# EAGLE design beacon7012 (EAGLE 6.5.0)
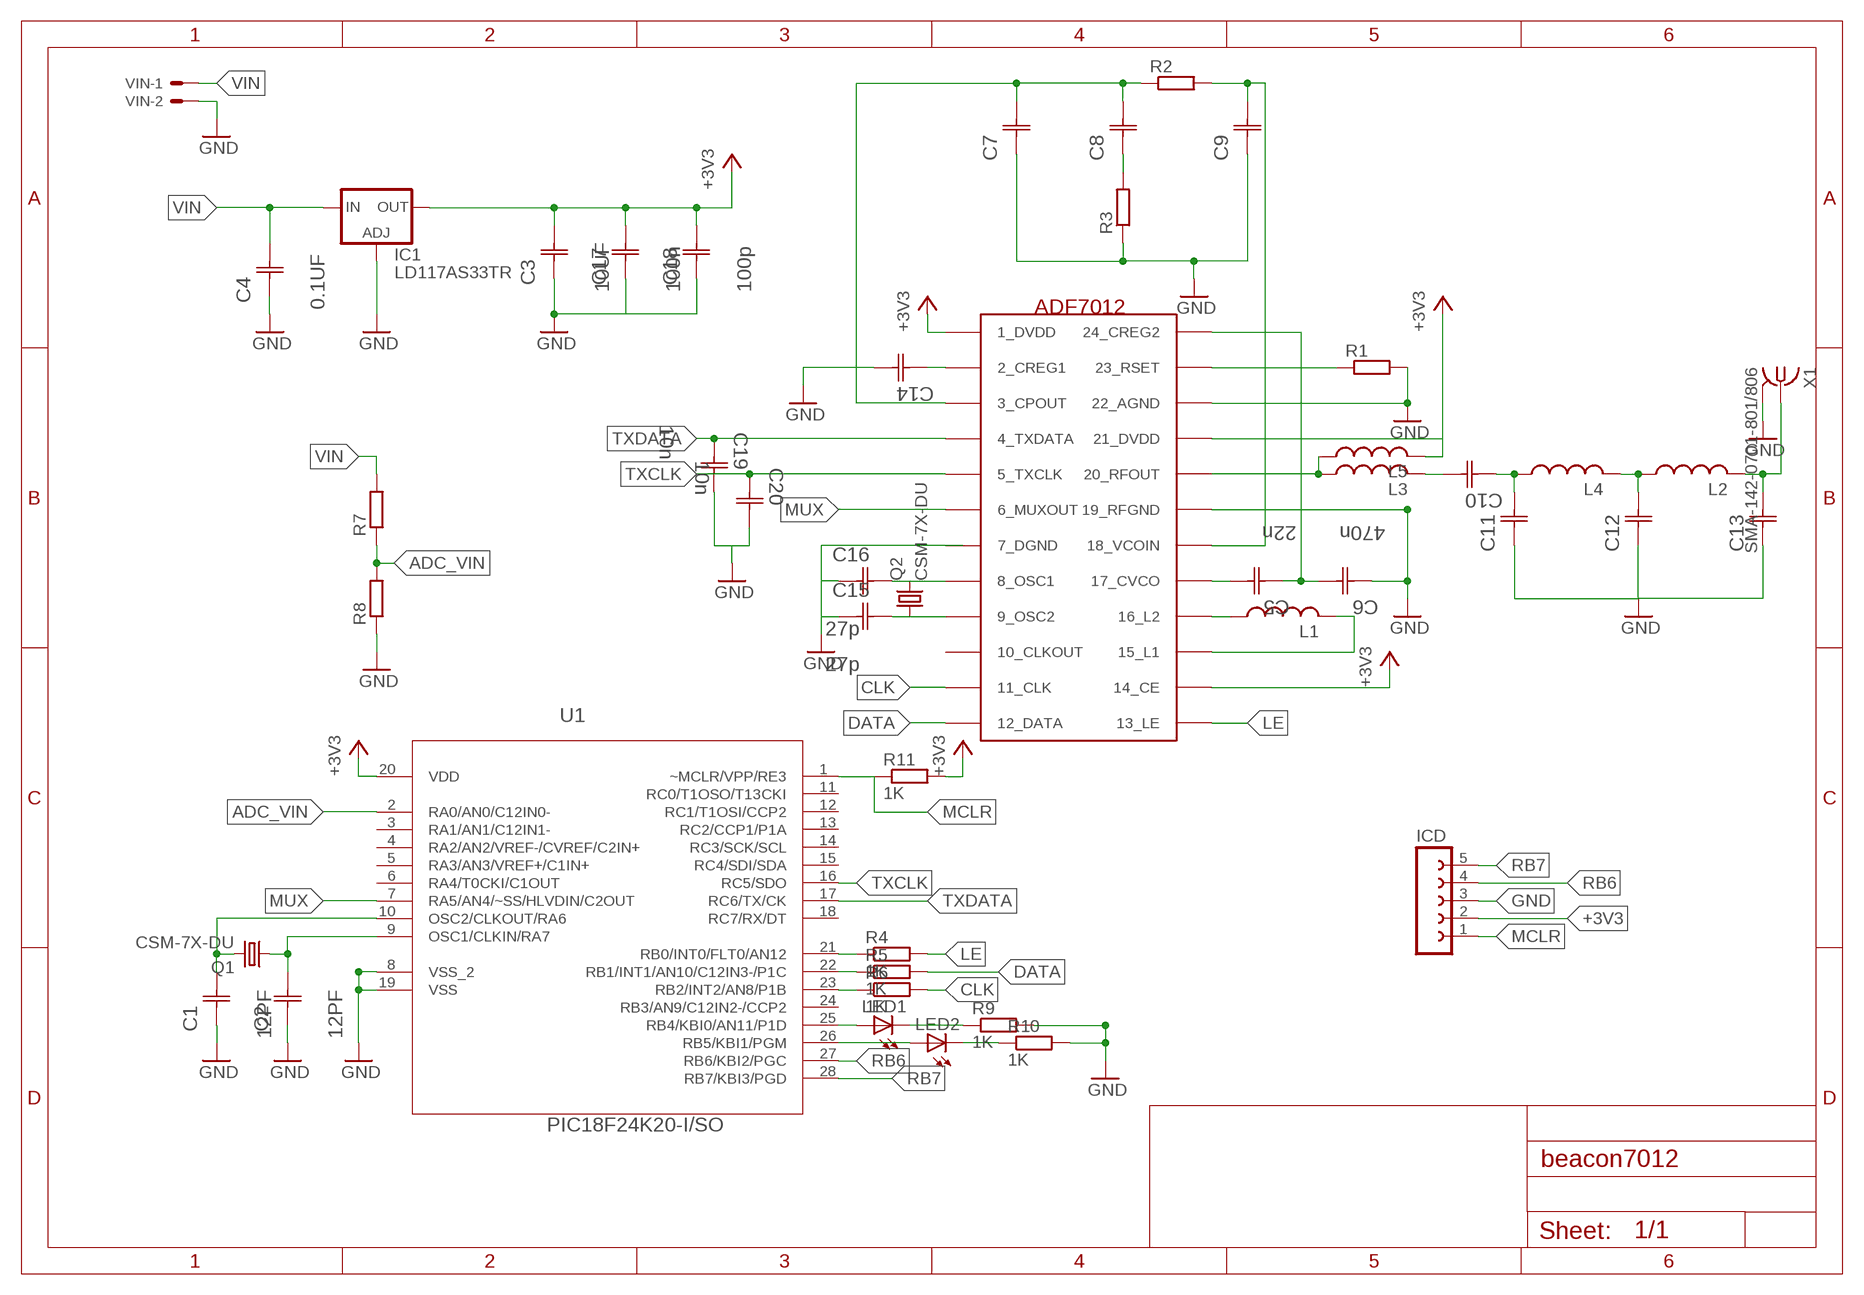
[diagram p0: schematic, sheet 1]

## Parts
C1  12PF  0805YA120JAT2A  [CAPC2012X94N]
C2  12PF  0805YA120JAT2A  [CAPC2012X94N]
C3  10UF  0805YD106MAT2A  [CAPC2013X140N]
C4  0.1UF  0805ZC104MAT2A  [CAPC2012X94N]
C5  22n  0805ZC104MAT2A  [CAPC2012X94N]
C6  470n  0805ZC104MAT2A  [CAPC2012X94N]
C7  0805YD106MAT2A  [CAPC2013X140N]
C8  0805YD106MAT2A  [CAPC2013X140N]
C9  0805YD106MAT2A  [CAPC2013X140N]
C10  0805ZC104MAT2A  [CAPC2012X94N]
C11  0805YD106MAT2A  [CAPC2013X140N]
C12  0805YD106MAT2A  [CAPC2013X140N]
C13  0805YD106MAT2A  [CAPC2013X140N]
C14  0805ZC104MAT2A  [CAPC2012X94N]
C15  27p  0805ZC104MAT2A  [CAPC2012X94N]
C16  27p  0805ZC104MAT2A  [CAPC2012X94N]
C17  100n  0805YD106MAT2A  [CAPC2013X140N]
C18  100p  0805YD106MAT2A  [CAPC2013X140N]
C19  10n  0805ZC104MAT2A  [CAPC2012X94N]
C20  10n  0805ZC104MAT2A  [CAPC2012X94N]
IC1  LD117AS33TR  [SOT223]
ICD  FE05-1  [FE05-1]
L1  L-USL2825P  [L2825P]
L2  L-USL2825P  [L2825P]
L3  L-USL2825P  [L2825P]
L4  L-USL2825P  [L2825P]
L5  L-USL2825P  [L2825P]
LED1  LEDSML0805  [SML0805]
LED2  LEDSML0805  [SML0805]
Q1  CSM-7X-DU  [CSM-7X-DU]
Q2  CSM-7X-DU  [CSM-7X-DU]
R1  R-EU_R0805  [R0805]
R2  R-EU_R0805  [R0805]
R3  R-EU_R0805  [R0805]
R4  1K  R-EU_R0805  [R0805]
R5  1K  R-EU_R0805  [R0805]
R6  1K  R-EU_R0805  [R0805]
R7  R-EU_R0805  [R0805]
R8  R-EU_R0805  [R0805]
R9  1K  R-EU_R0805  [R0805]
R10  1K  R-EU_R0805  [R0805]
R11  1K  R-EU_R0805  [R0805]
U1  PIC18F24K20-I/SO  [SOIC127P1030X265-28N]
U$1  ADF7012  [ADF7012]
VIN  KK-156-2  [KK-156-2]
X1  SMA-142-0701-801/806  [J502-ND-142-0701-801/806]

## Nets
+3V3: C3.2(C2) C17.2(C2) C18.2(C2) IC1.4(OUT) ICD.2 L5.2 R11.2 U1.20(VDD) U$1.1_DVDD U$1.14_CE U$1.21_DVDD
ADC_VIN: R7.1 R8.2 U1.2(RA0/AN0/C12IN0-)
CLK: R6.2 U$1.11_CLK
DATA: R5.2 U$1.12_DATA
GND: C1.1(C1) C2.1(C1) C3.1(C1) C4.1(C1) C6.1(C1) C7.1(C1) C9.1(C1) C11.1(C1) C12.1(C1) C13.1(C1) C14.2(C2) C15.1(C1) C16.1(C1) C17.1(C1) C18.1(C1) C19.2(C2) C20.2(C2) IC1.1(ADJ) ICD.3 R1.2 R3.1 R8.1 R9.2 R10.2 U1.8(VSS_2) U1.19(VSS) U$1.19_RFGND U$1.22_AGND VIN.2 X1.G@1 X1.G@2 X1.G@3 X1.G@4
LE: R4.2 U$1.13_LE
MCLR: ICD.1 R11.1 U1.1(~MCLR/VPP/RE3)
MUX: U1.7(RA5/AN4/~SS/HLVDIN/C2OUT) U$1.6_MUXOUT
N$1: C1.2(C2) Q1.2 U1.10(OSC2/CLKOUT/RA6)
N$2: C2.2(C2) Q1.1 U1.9(OSC1/CLKIN/RA7)
N$3: R5.1 U1.22(RB1/INT1/AN10/C12IN3-/P1C)
N$6: C16.2(C2) Q2.2 U$1.8_OSC1
N$8: R1.1 U$1.23_RSET
N$9: L1.1 U$1.16_L2
N$10: L1.2 U$1.15_L1
N$11: C5.2(C2) U$1.17_CVCO
N$12: C5.1(C1) C6.2(C2) U$1.24_CREG2
N$13: C7.2(C2) C8.2(C2) R2.1 U$1.3_CPOUT
N$14: C9.2(C2) R2.2 U$1.18_VCOIN
N$15: C8.1(C1) R3.2
N$16: C12.2(C2) L2.1 L4.2
N$17: L3.1 L5.1 U$1.20_RFOUT
N$18: C10.1(C1) C11.2(C2) L4.1
N$19: C13.2(C2) L2.2 X1.1
N$20: C15.2(C2) Q2.1 U$1.9_OSC2
N$21: LED1.A U1.25(RB4/KBI0/AN11/P1D)
N$22: C10.2(C2) L3.2
N$23: C14.1(C1) U$1.2_CREG1
N$24: R6.1 U1.23(RB2/INT2/AN8/P1B)
N$25: R4.1 U1.21(RB0/INT0/FLT0/AN12)
N$26: LED2.A U1.26(RB5/KBI1/PGM)
N$27: LED1.C R9.1
N$28: LED2.C R10.1
RB6: ICD.4 U1.27(RB6/KBI2/PGC)
RB7: ICD.5 U1.28(RB7/KBI3/PGD)
TXCLK: C20.1(C1) U1.16(RC5/SDO) U$1.5_TXCLK
TXDATA: C19.1(C1) U1.17(RC6/TX/CK) U$1.4_TXDATA
VIN: C4.2(C2) IC1.3(IN) R7.2 VIN.1
Unconnected: U1.3(RA1/AN1/C12IN1-) U1.4(RA2/AN2/VREF-/CVREF/C2IN+) U1.5(RA3/AN3/VREF+/C1IN+) U1.6(RA4/T0CKI/C1OUT) U1.11(RC0/T1OSO/T13CKI) U1.12(RC1/T1OSI/CCP2) U1.13(RC2/CCP1/P1A) U1.14(RC3/SCK/SCL) U1.15(RC4/SDI/SDA) U1.18(RC7/RX/DT) U1.24(RB3/AN9/C12IN2-/CCP2) U$1.7_DGND U$1.10_CLKOUT

## Library data of the parts
C1 C2 = AVX_By_element14_Batch_1:0805YA120JAT2A: Capacitor 0805; MPN: 0805YA120JAT2A; OC_FARNELL: -; OC_NEWARK: 55J5411; SUPPLIER: AVX; TOLERANCE: ± 5%; VOLTAGERATING: 16V
C3 = AVX_By_element14_Batch_1:0805YD106MAT2A: Capacitor 0805; MPN: 0805YD106MAT2A; OC_FARNELL: 1582704; OC_NEWARK: 66M3391; SUPPLIER: AVX; TOLERANCE: ±20%; VOLTAGERATING: 16V
C4 = AVX_By_element14_Batch_1:0805ZC104MAT2A: Capacitor 0805; MPN: 0805ZC104MAT2A; OC_FARNELL: -; OC_NEWARK: 55J5552; SUPPLIER: AVX; TOLERANCE: ±20%; VOLTAGERATING: 10V
C5 C6 C10 C14-C16 C19 C20 = AVX_By_element14_Batch_1:0805ZC104MAT2A: Capacitor 0805; MPN: 0805ZC104MAT2A; OC_FARNELL: -; OC_NEWARK: 55J5552; SUPPLIER: AVX; TOLERANCE: ±20%; VALUE: 0.1UF; VOLTAGERATING: 10V
C7-C9 C11-C13 C17 C18 = AVX_By_element14_Batch_1:0805YD106MAT2A: Capacitor 0805; MPN: 0805YD106MAT2A; OC_FARNELL: 1582704; OC_NEWARK: 66M3391; SUPPLIER: AVX; TOLERANCE: ±20%; VALUE: 10UF; VOLTAGERATING: 16V
IC1 = v-reg:LD117A?*: Low drop fixed and adjustable positive voltage regulators 1 A Source: http://www.st.com/stonline/products/literature/ds/7194/ld1117axx.pdf
ICD = con-lsta:FE05-1: FEMALE HEADER; OC_FARNELL: unknown; OC_NEWARK: unknown
L1-L5 = resistor:L-US: INDUCTOR, American symbol
LED1 LED2 = led:LED: LED OSRAM: - CHIPLED LG R971, LG N971, LY N971, LG Q971, LY Q971, LO R971, LY R971 LH N974, LH R974 LS Q976, LO Q976, LY Q976 LO Q996 - Hyper CHIPLED LW Q18S LB Q993, LB Q99A, LB R99A - SideLED LS A670, LO A670, LY A670, LG A670, LP A670 LB A673, LV A673, LT A673, LW A673 LH A674 LY A675 LS A676, LA A676, LO A676, LY A676, LW A676 LS A679, LY A679, LG A679 - Hyper Micro SIDELED® LS Y876, LA Y876, LO Y876, LY Y876 LT Y87S - SmartLED LW L88C, LW L88S LB L89C, LB L89S, LG L890 LS L89K, LO L89K, LY L89K LS L896, LA L896, LO L896, LY L896 - TOPLED LS T670, LO T670, LY T670, LG T670, LP T670 LSG T670, LSP T670, LSY T670, LOP T670, LYG T670 LG T671, LOG T671, LSG T671 LB T673, LV T673, LT T673, LW T673 LH T674 LS T676, LA T676, LO T676, LY T676, LB T676, LH T676, LSB T676, LW T676 LB T67C, LV T67C, LT T67C, LS T67K, LO T67K, LY T67K, LW E67C LS E67B, LA E67B, LO E67B, LY E67B, LB E67C, LV E67C, LT E67C LW T67C LS T679, LY T679, LG T679 LS T770, LO T770, LY T770, LG T770, LP T770 LB T773, LV T773, LT T773, LW T773 LH T774 LS E675, LA E675, LY E675, LS T675 LS T776, LA T776, LO T776, LY T776, LB T776 LHGB T686 LT T68C, LB T68C - Hyper Mini TOPLED® LB M676 - Mini TOPLED Santana® LG M470 LS M47K, LO M47K, LY M47K Source: http://www.osram.convergy.de LUXEON: - LUMILED® LXK2-PW12-R00, LXK2-PW12-S00, LXK2-PW14-U00, LXK2-PW14-V00 LXK2-PM12-R00, LXK2-PM12-S00, LXK2-PM14-U00 LXK2-PE12-Q00, LXK2-PE12-R00, LXK2-PE12-S00, LXK2-PE14-T00, LXK2-PE14-U00 LXK2-PB12-K00, LXK2-PB12-L00, LXK2-PB12-M00, LXK2-PB14-N00, LXK2-PB14-P00, LXK2-PB14-Q00 LXK2-PR12-L00, LXK2-PR12-M00, LXK2-PR14-Q00, LXK2-PR14-R00 LXK2-PD12-Q00, LXK2-PD12-R00, LXK2-PD12-S00 LXK2-PH12-R00, LXK2-PH12-S00 LXK2-PL12-P00, LXK2-PL12-Q00, LXK2-PL12-R00 Source: www.luxeon.com KINGBRIGHT: KA-3528ASYC Source: www.kingbright.com
Q1 Q2 = crystal:CSM-7X-DU: SMD CRYSTAL Source: www.ecsxtal.com .. Crystal 3.6864MHz CSM_7X_DU.PDF; OC_FARNELL: unknown; OC_NEWARK: unknown
R1-R11 = resistor:R-EU_: RESISTOR, European symbol
U1 = mymikro:PIC18F24K20-I/SO: Flash Microcontrollers; DESCRIPTION: Flash Microcontrollers; MPN: PIC18F24K20-I/SO; OC_FARNELL: 1439574; OC_NEWARK: 88K5967; PACKAGE: SOIC-28; SUPPLIER: Microchip
U$1 = Ava:ADF7012: ADF7012 Multichannel ISM Band FSK/GFSK/OOK/GOOK/ASK Transmitter http://www.analog.com/static/imported-files/data_sheets/ADF7012.pdf
VIN = con-molex:KK-156-2: KK 156 HEADER Source: http://www.molex.com/pdm_docs/sd/026604100_sd.pdf; OC_FARNELL: unknown; OC_NEWARK: unknown
X1 = con-coax:SMA-: SMA 50 Ohm End Launch Jack Receptacle - Round Contact Johnson Components Source: www.johnsoncomponents.com .. J502-ND.pdf; MF: JOHNSON COMPONENTS; MPN: 142-0701-801; OC_FARNELL: 1608592; OC_NEWARK: 90F2624

## Board
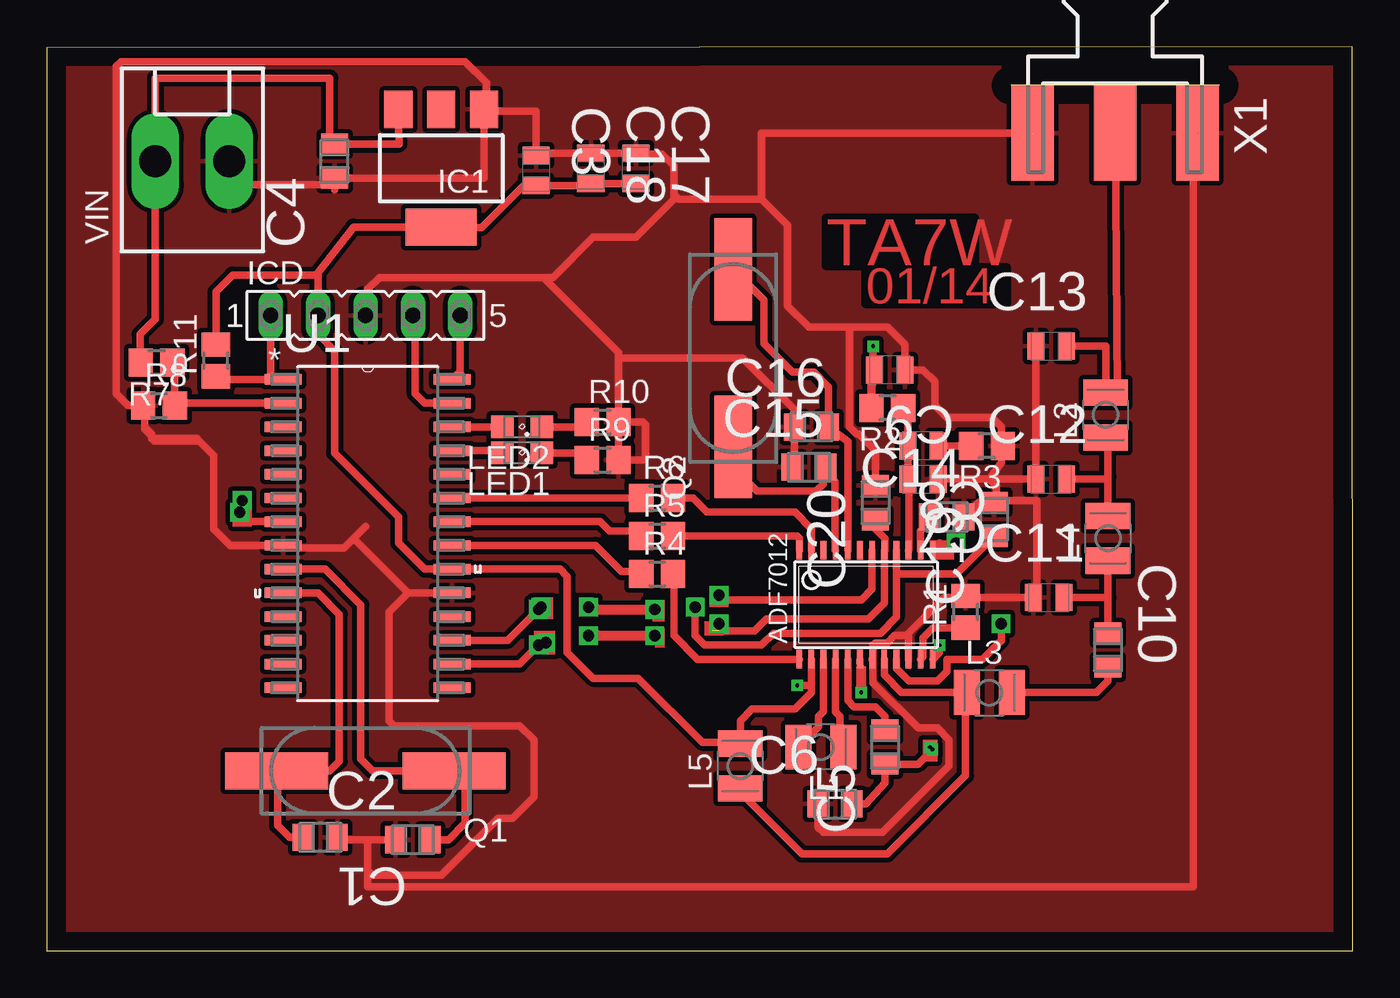
[diagram p1: board, top side]
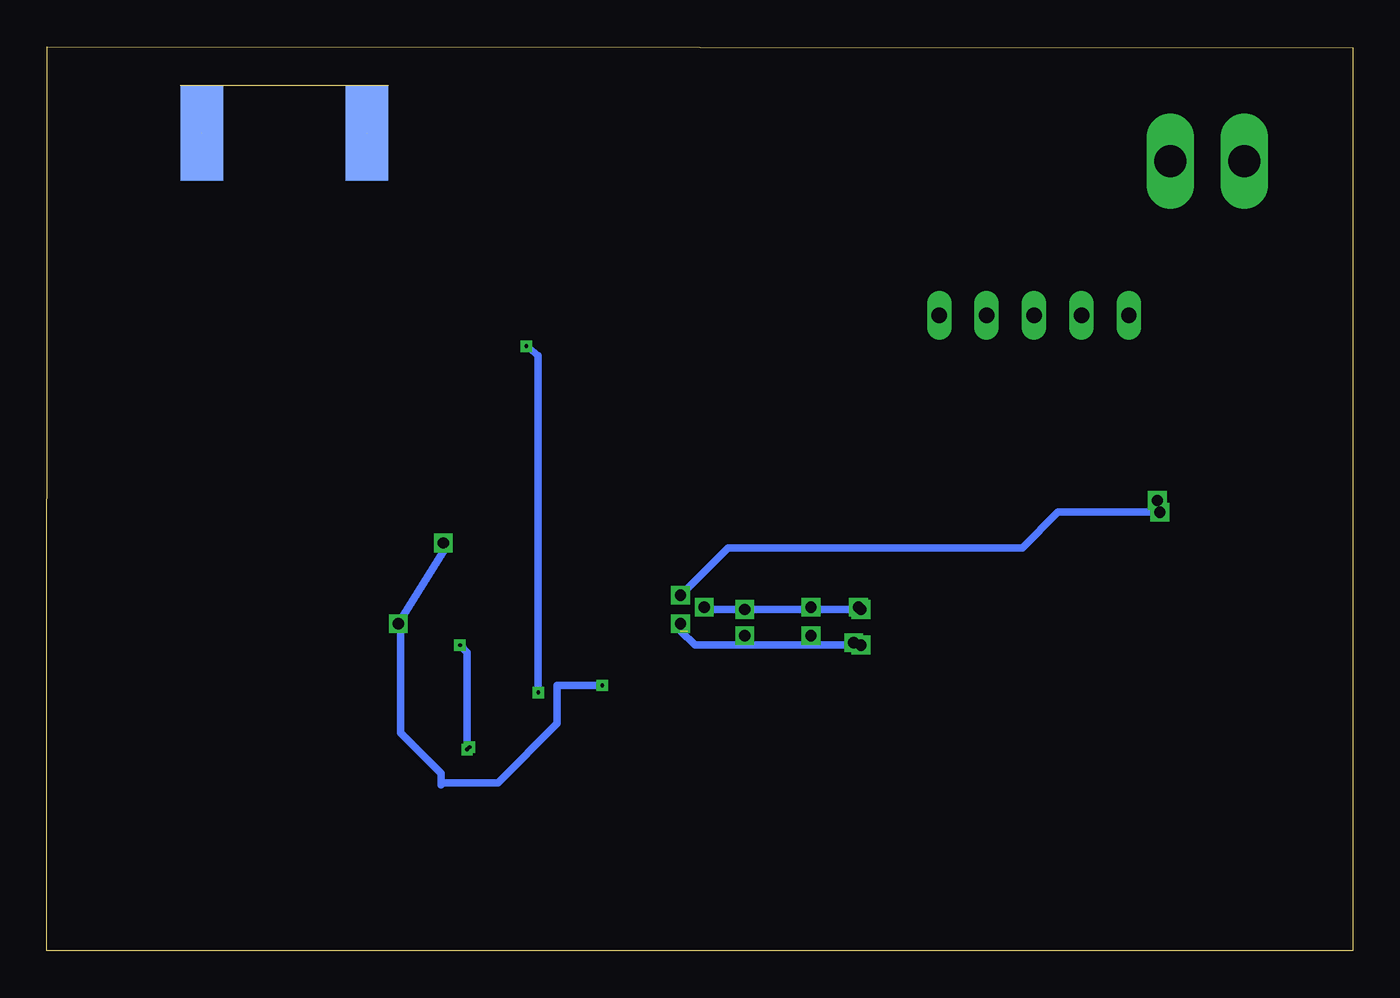
[diagram p2: board, bottom side, seen from below]

Size 69.92 x 48.41 mm. Coordinates in mm from the lower left corner, seen from the top.
Outline: 0,0.02 69.92,0 69.89,48.41 0,48.35 0,0.02
Copper layers (1*16): Top 0.035mm / dielectric 1.5mm / Bottom 0.035mm
Design rules "default": minimum track width 10mil, minimum drill 24mil, track to track 8mil, track to pad 8mil, pad to pad 8mil, via to via 8mil, smd to smd 8mil, copper to edge 40mil, drill to drill 8mil, minimum pad ring 10mil, minimum via ring 8mil, stop-mask expansion 4mil, vias tented up to drill 0mil, thermal gap 10mil

### Footprints (pad centres in the part's own frame; a part is rotated, then mirrored left to right if it is on the bottom)
CAPC2012X94N = smd 1.118 x 1.448: 1 -0.914,0; 2 0.914,0
CAPC2013X140N = smd 0.914 x 1.448: 1 -0.813,0; 2 0.813,0
SOT223 = smd 1.5 x 2: 1 -2.3,-3.15; 2 0,-3.15; 3 2.3,-3.15 | smd 3.8 x 2: 4 0,3.15
FE05-1 = drill 0.813 long: 1 -5.08,0; 2 -2.54,0; 3 0,0; 4 2.54,0; 5 5.08,0
L2825P = smd 1.4 x 2.4: 1 -1.2,0; 2 1.2,0
SML0805 = smd 1.2 x 1.2: A 1.05,0; C -1.05,0
CSM-7X-DU = smd 5.5 x 2: 1 -4.75,0; 2 4.75,0
R0805 = smd 1.3 x 1.5: 1 -0.85,0; 2 0.85,0
SOIC127P1030X265-28N = smd 1.981 x 0.559: 1 -4.521,8.255; 2 -4.521,6.985; 3 -4.521,5.715; 4 -4.521,4.445; 5 -4.521,3.175; 6 -4.521,1.905; 7 -4.521,0.635; 8 -4.521,-0.635; 9 -4.521,-1.905; 10 -4.521,-3.175; 11 -4.521,-4.445; 12 -4.521,-5.715; 13 -4.521,-6.985; 14 -4.521,-8.255; 15 4.521,-8.255; 16 4.521,-6.985; 17 4.521,-5.715; 18 4.521,-4.445; 19 4.521,-3.175; 20 4.521,-1.905; 21 4.521,-0.635; 22 4.521,0.635; 23 4.521,1.905; 24 4.521,3.175; 25 4.521,4.445; 26 4.521,5.715; 27 4.521,6.985; 28 4.521,8.255
ADF7012 = smd 0.991 x 0.305: 1_DVDD -5.458,8.655; 2_CREG1 -5.458,8.005; 3_CPOUT -5.458,7.355; 4_TXDATA -5.458,6.705; 5_TXCLK -5.458,6.055; 6_MUXOUT -5.458,5.405; 7_DGND -5.458,4.755; 8_OSC1 -5.458,4.105; 9_OSC2 -5.458,3.455; 10_CLKOUT -5.458,2.805; 11_CLK -5.458,2.155; 12_DATA -5.458,1.505; 13_LE 0.378,1.505; 14_CE 0.378,2.155; 15_L1 0.378,2.805; 16_L2 0.378,3.455; 17_CVCO 0.378,4.105; 18_VCOIN 0.378,4.755; 19_RFGND 0.378,5.405; 20_RFOUT 0.378,6.055; 21_DVDD 0.378,6.705; 22_AGND 0.378,7.355; 23_RSET 0.378,8.005; 24_CREG2 0.378,8.655
KK-156-2 = drill 1.7 pad 2.184 long: 1 -1.98,0; 2 1.98,0
J502-ND-142-0701-801/806 = smd 5.08 x 2.286: 1 2.565,0; G@1 2.565,4.42; G@2 2.565,-4.42 | smd 5.08 x 2.286 bottom: G@3 2.565,4.42; G@4 2.565,-4.42

### Placement (x,y rotation side)
C1  14.65,6.09 180 top
C2  19.6,5.96 0 top
C3  26.2,41.77 270 top
C4  15.41,42.28 90 top
C5  44.87,10.91 90 top
C6  42.21,7.86 0 top
C7  46.91,25.26 180 top
C8  46.91,27.04 180 top
C9  45.13,31.11 180 top
C10  56.81,16.12 270 top
C11  53.64,18.91 0 top
C12  53.76,25.26 0 top
C13  53.76,32.38 0 top
C14  48.18,23.23 0 top
C15  40.81,25.9 0 top
C16  40.94,28.06 0 top
C17  31.54,41.9 270 top
C18  29.12,41.9 270 top
C19  50.72,23.1 90 top
C20  44.37,23.99 90 top
IC1  21.12,41.9 180 top
ICD  17.06,34.03 0 top
L1  41.44,10.91 180 top
L2  56.68,28.69 90 top
L3  50.46,13.83 0 top
L4  56.81,22.09 90 top
L5  37.13,9.9 90 top
LED1  25.44,26.66 180 top
LED2  25.44,28.06 180 top
Q1  17.06,9.64 180 top
Q2  36.75,31.74 90 top
R1  49.19,18.15 90 top
R2  45,29.07 180 top
R3  50.33,27.04 180 top
R4  32.68,20.18 0 top
R5  32.68,22.21 0 top
R6  32.68,24.25 0 top
R7  5.88,31.49 180 top
R8  6.01,29.2 0 top
R9  29.76,26.28 0 top
R10  29.76,28.31 0 top
R11  9.06,31.61 90 top
U1  17.19,22.34 0 top
U$1  38.78,15.99 270 top
VIN  7.79,42.28 0 top
X1  57.19,46.34 270 top

### Tracks (layer width: path | path; a pad name or v marks a point on that pad's centre or on a via)
+3V3  (via drill 0.2 pad 0.25, 0.6)  (1 unrouted)
  Top 0.406: C17.2 C18.2 29.12,40.96 C3.2 25.52,40.96 23.28,38.72 21.15,38.72 IC1.4 16.43,38.75 14.52,36.31 | 14.52,36.31 ICD.2 14.52,33.01 15.41,32.12 15.41,26.66 18.84,23.23 18.84,21.83 20.23,20.44 U1.20 27.47,20.44 27.86,20.06 27.86,15.99 29.25,14.59 31.66,14.59 35.09,11.17 37.06,11.17 L5.2 37.13,12.31 37.76,12.94 40.05,12.94 40.93,13.83 U$1.14_CE | R11.2 9.06,35.3 9.95,36.18 14.39,36.18 14.52,36.31 | U$1.14_CE | U$1.21_DVDD 45.48,15.13 46.14,14.47 47.67,14.47 48.18,14.98 48.18,15.61 50.08,15.61 51.1,16.63 v51.1,17.52 | U$1.1_DVDD 47.79,21.83 48.56,21.58 | U$1.14_CE 40.94,14.21 v40.17,14.21
  Bottom 0.406: 48.56,21.58 v51.1,17.52 50.97,17.39 50.97,11.67 48.81,9.51 48.81,8.88 48.68,9.01 45.76,9.01 42.59,12.18 42.59,14.21 v40.17,14.21
ADC_VIN
  Top 0.406: U1.2 6.99,29.33 R8.2 6.86,31.36 R7.1
CLK
  Top 0.406: R6.2 34.59,24.25 35.35,23.48 40.05,23.48 40.94,22.6 U$1.11_CLK
DATA
  Top 0.406: R5.2 40.17,22.21 40.3,22.09 40.3,21.47 U$1.12_DATA
GND  (2 unrouted)
  Top 0.406: VIN.2 9.69,42.28 9.69,41.01 15.41,41.01 | 15.41,41.01 15.41,40.76 | 15.41,41.01 C4.1 23.42,41.37 IC1.1 | IC1.1 23.42,44.95 26.2,44.95 C3.1 26.2,42.71 C18.1 C17.1 31.59,42.66 32.94,42.66 33.57,42.03 33.57,40.5 | C2.1 17.19,5.96 | 17.19,5.96 15.69,5.96 C1.1 | C7.1 50.46,25.26 | 50.46,25.26 51.1,26.15 R3.1 51.1,27.13 51.1,28.06 50.59,28.57 48.18,28.57 47.54,29.2 47.54,30.47 46.91,31.11 C9.1 45.94,32.45 45,33.39 42.97,33.39 | C13.1 C12.1 50.46,25.26 | 50.46,25.26 50.84,24.88 50.84,24.14 C19.2 49.88,24.02 C14.2 49.19,23.23 50.08,24.12 53,24.12 53,19.09 C11.1 49.28,18.91 R1.2 49.1,18.91 48.05,18.91 46.13,17 U$1.22_AGND 46.13,16.76 46.02,16.88 45.38,16.88 45,16.5 44.37,16.5 44.24,16.37 44.24,15.67 U$1.19_RFGND 44.24,15.56 44.24,14.34 46.65,11.93 47.67,11.93 48.3,11.29 48.3,9.9 44.75,6.34 41.57,6.34 41.29,6.62 C6.1 | R10.2 31.92,28.31 32.05,28.18 32.05,26.41 31.92,26.28 R9.2 30.61,31.74 | 17.06,22.72 16.43,22.09 | 16.43,22.09 15.92,21.58 12.79,21.58 U1.8 9.82,21.71 8.93,22.6 8.93,26.53 8.17,27.29 | U1.19 19.35,19.17 | 19.35,19.17 16.43,22.09 | 19.35,19.17 18.33,18.15 18.33,12.31 18.58,12.05 25.32,12.05 26.08,11.29 26.08,8.25 24.93,7.1 24.17,7.1 21.12,4.05 17.44,4.05 17.19,4.31 | 17.19,4.31 17.19,5.96 | 8.17,27.29 8.04,27.42 5.76,27.42 5.25,27.93 5.25,28.06 | 5.25,29.07 5.25,29.11 R8.1 | C15.1 40.02,26.03 C16.1 40.02,28.97 37.25,31.74 30.61,31.74 | 30.61,31.74 30.61,32.03 26.59,36.06 | 26.59,36.06 17.82,36.06 17.19,35.42 17.19,34.15 ICD.3 | 26.59,36.06 27.09,36.06 29.25,38.22 31.54,38.22 33.57,40.25 33.57,40.5 | 42.97,33.39 40.81,33.39 39.67,34.53 39.67,38.85 38.27,40.25
  Top 0.406: 38.27,40.25 33.82,40.25 33.57,40.5 | 8.17,27.29 5.76,27.29 5.63,27.42 5.63,27.68 5.25,28.06 | 5.25,28.06 5.25,29.07 | 5.25,29.07 5.12,29.2 4.36,29.2 3.73,29.83 3.73,47.36 3.98,47.61 22.39,47.61 23.54,46.47 23.54,45.16 IC1.1 | C20.2 44.37,26.79 43.48,27.68 43.35,27.68 42.97,28.06 42.97,33.39 | X1.G@4 38.27,43.78 38.27,40.25 | X1.G@3 61.38,46.07 61.38,3.42 17.19,3.42 17.19,4.31
  pour Top (isolate 0.254): 0.01,48.9 69.97,48.96 69.89,-0.06 -0.03,0.02
LE
  Top 0.406: U$1.13_LE 34.84,15.61 33.57,16.88 33.57,20.14 R4.2
MCLR
  Top 0.406: U1.1 12.11,30.6 | 12.11,30.6 9.22,30.6 R11.1 | ICD.1 11.98,30.72 12.11,30.6
MUX  (via drill 0.6)
  Top 0.406: U$1.6_MUXOUT 44.18,19.36 43.6,18.79 36.24,18.79 v35.98,19.04 | U1.7 10.84,22.98 v10.33,23.48
  Bottom 0.406: v10.33,23.48 15.79,23.48 17.7,21.58 33.44,21.58 v35.98,19.04
N$1
  Top 0.406: U1.10 14.52,19.17 15.66,18.02 15.66,10.15 15.15,9.64 Q1.2 12.36,9.59 12.36,6.72 13,6.09 C1.2
N$2
  Top 0.406: U1.9 14.9,20.44 16.81,18.53 16.81,10.28 17.44,9.64 Q1.1 22.06,9.39 22.39,9.39 22.39,6.85 21.5,5.96 C2.2
N$3
  Top 0.406: U1.22 29.63,22.98 30.14,22.47 31.58,22.47 R5.1
N$4  (via drill 0.6)
  other vias: 10.46,24.12
N$5  (via drill 0.6)
  other vias: 35.98,17.52
N$6
  Top 0.406: U$1.8_OSC1 42.88,27.28 C16.2 41.85,30.19 41.06,30.98 39.92,30.98 38.4,32.5 38.4,34.84 Q2.2
N$7  (via drill 0.6)
  other vias: 32.55,18.28
N$8
  Top 0.406: R1.1 47.45,17.3 46.91,16.75 46.91,15.74 U$1.23_RSET
N$9
  Top 0.406: U$1.16_L2 42.23,12.79 42.46,12.56 42.46,11.1 L1.1
N$10
  Top 0.406: U$1.15_L1 41.58,12.83 41.32,12.56 41.32,11.98 L1.2
N$11
  Top 0.406: U$1.17_CVCO 42.88,13.41 43.22,13.07 44.37,13.07 44.87,12.56 C5.2
N$12  (via drill 0.2 pad 0.25)
  Top 0.406: C6.2 43.86,7.86 44.87,9.01 C5.1 46.63,10 v47.41,10.79 | v47.79,16.37 47.79,15.98 U$1.24_CREG2
  Bottom 0.406: v47.41,10.79 47.41,15.99 v47.79,16.37
N$13
  Top 0.406: U$1.3_CPOUT 46.14,21.46 46.14,24.75 46.19,24.81 C7.2 C8.2 46.09,28.83 R2.1 46.07,29.11
N$14  (via drill 0.2 pad 0.25)
  Top 0.406: C9.2 44.31,30.93 44.11,30.72 44.11,29.11 R2.2 44.24,31.36 v44.24,32.38 | v43.6,13.83 U$1.18_VCOIN
  Bottom 0.406: v44.24,32.38 43.6,31.87 v43.6,13.83
N$15
  Top 0.406: C8.1 R3.2
N$16
  Top 0.406: L4.2 56.81,25.39 | 56.81,25.39 56.81,27.36 L2.1 | C12.2 56.68,25.26 56.81,25.39
N$17
  Top 0.406: U$1.20_RFOUT 44.83,14.76 45.76,13.83 L3.1 49.19,13.76 49.19,9.39 45,5.2 40.43,5.2 37.13,8.5 L5.1
N$18
  Top 0.406: 56.3,20.38 L4.1 56.81,18.91 | C10.1 56.81,18.91 | C11.2 56.81,18.91
N$19
  Top 0.406: C13.2 56.68,32.38 L2.2 57.32,29.89 X1.1
N$20
  Top 0.406: Q2.1 36.75,26.41 37.13,26.03 37.13,25.52 38.02,24.63 41.19,24.63 41.57,25.01 41.57,25.75 C15.2 41.72,25.62 42.21,25.14 42.21,21.48 U$1.9_OSC2
N$21
  Top 0.406: U1.25 24.27,26.79 LED1.A
N$22
  Top 0.406: L3.2 56.18,13.83 56.81,14.47 C10.2
N$23
  Top 0.406: C14.1 47.26,22.95 46.78,22.47 U$1.2_CREG1
N$24
  Top 0.406: U1.23 R6.1
N$25
  Top 0.406: U1.21 29.38,21.71 30.78,20.31 31.7,20.31 R4.1
N$26
  Top 0.406: U1.26 LED2.A
N$27
  Top 0.406: LED1.C 28.53,26.66 R9.1
N$28
  Top 0.406: LED2.C 28.66,28.06 R10.1
N$29  (via drill 0.6)
  other vias: 32.55,16.88
N$30  (via drill 0.6)
  other vias: 29,18.4
N$31  (via drill 0.6)
  other vias: 29,16.88
N$32  (via drill 0.6)
  other vias: 26.46,18.4
N$33  (via drill 0.6)
  other vias: 26.71,16.5
N$34  (via drill 0.6)
  other vias: 51.1,17.52
N$35  (via drill 0.6)
  other vias: 48.68,21.83
N$36  (via drill 0.2 pad 0.25)
  other vias: 43.6,13.83
N$37  (via drill 0.2 pad 0.25)
  other vias: 44.24,32.38
N$38  (via drill 0.2 pad 0.25)
  other vias: 47.79,16.37
N$39  (via drill 0.2 pad 0.25)
  other vias: 47.29,10.91
N$40  (via drill 0.2 pad 0.25)
  other vias: 40.17,14.21
RB6
  Top 0.406: U1.27 20.23,29.33 19.73,29.83 19.73,33.9 ICD.4
RB7
  Top 0.406: ICD.5 22.14,31.03 U1.28
TXCLK  (via drill 0.6)  (1 unrouted)
  Top 0.406: C20.1 44.37,22.6 44.87,22.09 44.87,21.41 U$1.5_TXCLK 44.83,18.62 43.98,17.77 38.52,17.77 37.89,17.14 35.6,17.14 35.48,17.26 | U1.16 25.32,15.36 v26.33,16.37
  Bottom 0.406: v26.33,16.37 35.22,16.37 35.98,17.14
TXDATA  (via drill 0.6)
  Top 0.406: U$1.4_TXDATA 45.48,20.34 | 45.48,20.34 45.64,20.18 48.71,20.18 C19.1 | U1.17 24.68,16.63 v26.33,18.28 | 45.48,20.34 45.48,17.87 44.62,17.01 38.9,17.01 38.27,16.37 35.22,16.37 34.71,16.88 v34.71,18.4 34.71,18.53
  Bottom 0.406: v26.33,18.28 34.59,18.28 v34.71,18.4
VIN
  Top 0.406: IC1.3 18.85,43.19 C4.2 15.15,43.19 15.15,46.73 5.81,46.73 VIN.1 5.81,33.82 5,33.01 5,31.53 R7.2
(copper drawn outside any net)
  shapes: Top area x17

### Text on the board
Top: TA7W | 01/14